# EAGLE design novanet (EAGLE 9.5.1)
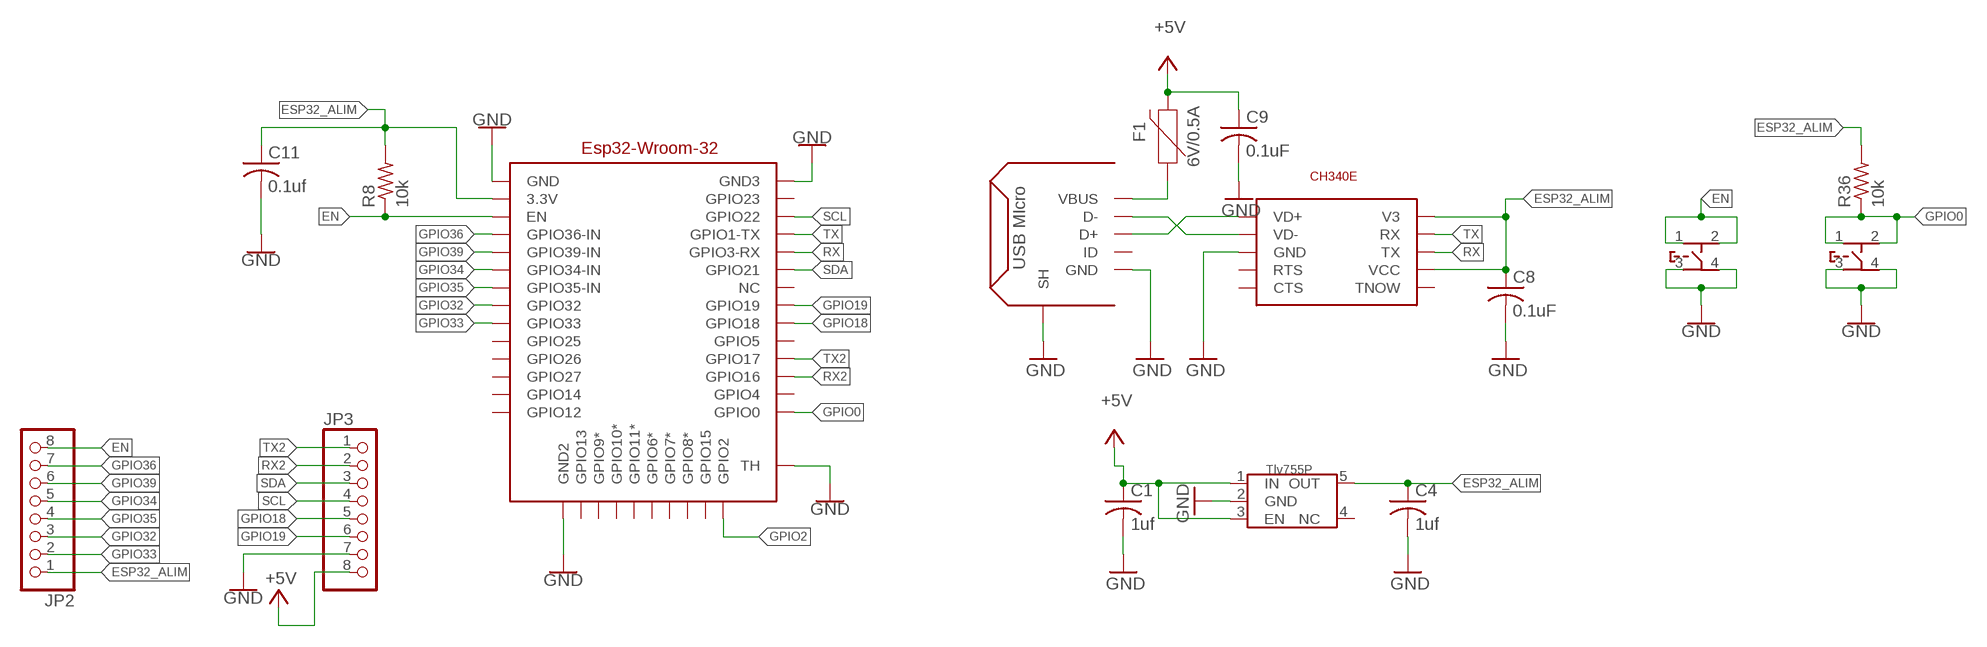
[diagram p0: schematic, sheet 1]

## Parts
C1  1uf  C-USC0603  [C0603]
C4  1uf  C-USC0603  [C0603]
C8  0.1uF  C-USC0603  [C0603]
C9  0.1uF  C-USC0603  [C0603]
C11  0.1uf  C-USC0603  [C0603]
F1  6V/0.5A  PPTC_HALF-AMP  [1206]
JP2  PINHD-1X8  [1X08]
JP3  PINHD-1X8  [1X08]
R8  10k  R-US_R0603  [R0603]
R36  10k  R-US_R0603  [R0603]
U$1  TLV755P-3.3SOT-23-5  [DBV_R-PDSO-G5]
U$3  CH340E  [MSOP-10]
U$4  ESP32-WROM-32  [ESP-32FOOTPRINT]
U$14  USB-MICROTIPOC  [USB-MICRO]
U$22  XUNPU  [TS-1089S]
U$23  XUNPU  [TS-1089S]

## Nets
+5V: C1.1 C9.1 F1.2 JP3.8 U$1.1(IN) U$1.3(EN)
EN: JP2.8 R8.1 U$4.EN U$22.1 U$22.2
ESP32_ALIM: C4.1 C8.1 C11.1 JP2.1 R8.2 R36.2 U$1.5(OUT) U$3.V3 U$3.VCC U$4.3.3V
GND: C1.2 C4.2 C8.2 C9.2 C11.2 JP3.7 U$1.2(GND) U$3.GND U$4.GND U$4.GND2 U$4.GND3 U$4.TH U$14.GND U$14.P$1(SH) U$14.P$2(SH) U$14.P$3(SH) U$14.P$4(SH) U$22.3 U$22.4 U$23.3 U$23.4
GPIO0: R36.1 U$4.GPIO0 U$23.1 U$23.2
GPIO2: U$4.GPIO2
GPIO18: JP3.5 U$4.GPIO18
GPIO19: JP3.6 U$4.GPIO19
GPIO32: JP2.3 U$4.GPIO32
GPIO33: JP2.2 U$4.GPIO33
GPIO34: JP2.5 U$4.GPIO34(GPIO34-IN)
GPIO35: JP2.4 U$4.GPIO35(GPIO35-IN)
GPIO36: JP2.7 U$4.GPIO36(GPIO36-IN)
GPIO39: JP2.6 U$4.GPIO39(GPIO39-IN)
N$3: U$3.VD- U$14.D-
N$4: U$3.VD+ U$14.D+
N$5: F1.1 U$14.VBUS
RX: U$3.TX U$4.GPIO3(GPIO3-RX)
RX2: JP3.2 U$4.GPIO16
SCL: JP3.4 U$4.GPO22(GPIO22)
SDA: JP3.3 U$4.GPIO21
TX: U$3.RX U$4.GPIO1(GPIO1-TX)
TX2: JP3.1 U$4.GPIO17
Unconnected: U$1.4(NC) U$3.CTS U$3.RTS U$3.TNOW U$4.GPIO4 U$4.GPIO5 U$4.GPIO6(GPIO6*) U$4.GPIO7(GPIO7*) U$4.GPIO8(GPIO8*) U$4.GPIO9(GPIO9*) U$4.GPIO10(GPIO10*) U$4.GPIO11(GPIO11*) U$4.GPIO12 U$4.GPIO13 U$4.GPIO14 U$4.GPIO15 U$4.GPIO23 U$4.GPIO25 U$4.GPIO26 U$4.GPIO27 U$4.NC U$14.ID

## Library data of the parts
C1 C4 C8 C9 C11 = rcl:C-US: CAPACITOR, American symbol; SPICEPREFIX: C
F1 = SparkFun-Fuses:PPTC: Resettable Fuse PPTC Resettable Fuse. Really a sort of resistor with a polymeric positive temperature coefficient whose resistance increases dramatically with an increase in temperature. When heated by the power passing through the resistance rises causing the current to be limited, protecting the circuit. This is achieved by the transition of the polymer from a crystalline to an amorphous state where the conductive carbon separates breaking the conductive pathways found in the cool crystalline structure. When a PPTC cools back down it resumes conducting letting the circuit turn back on. SparkFun Products: SparkFun RedBoard - Programmed with Arduino <https://www.sparkfun.com/products/12757> Pro Micro - 5V/16MHz <https://www.sparkfun.com/products/12640> Arduino Pro 328 - 5V/16MHz <https://www.sparkfun.com/products/10915> MP3 Trigger <https://www.sparkfun.com/products/13720>; PROD_ID: RES-08585
JP2 JP3 = pinhead:PINHD-1X8: PIN HEADER
R8 R36 = adafruit:R-US_: RESISTOR, American symbol
U$1 = tlv755p-3.3v:TLV755P-3.3
U$3 = Ch340E:CH340E
U$4 = Esp32-wrom-32:ESP32-WROM-32
U$14 = UsB micro:USB-MICROTIPOC
U$22 U$23 = TS-1089S-02526:XUNPU

## Board
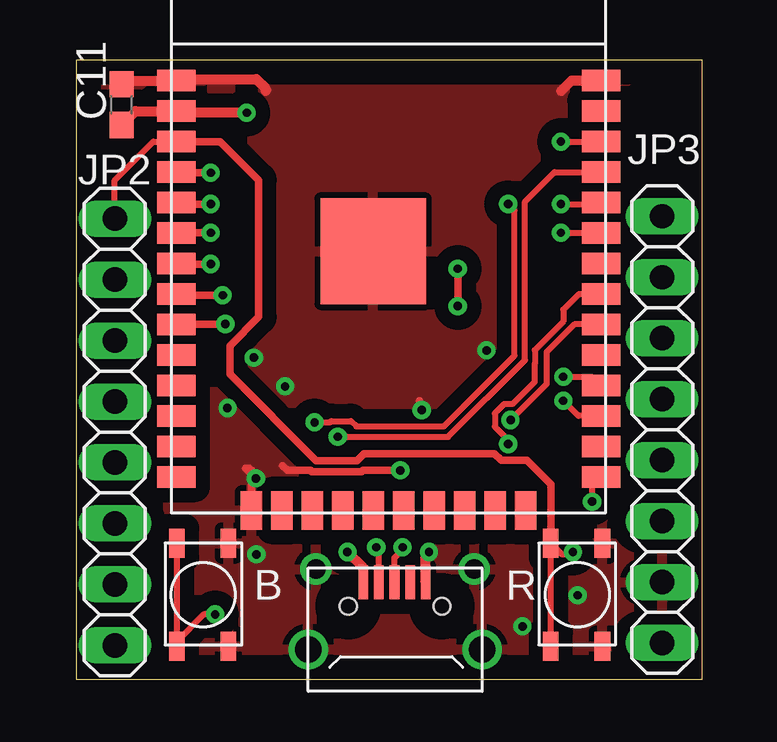
[diagram p1: board, top side]
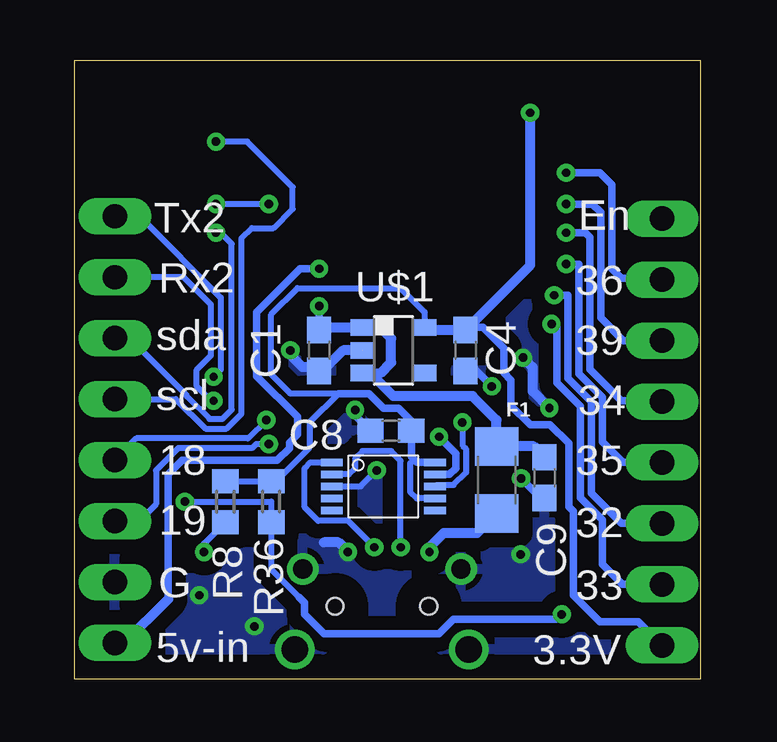
[diagram p2: board, bottom side, seen from below]

Size 26.1 x 25.8 mm. Coordinates in mm from the lower left corner, seen from the top.
Outline: 0,0 26.1,0 26.1,25.8 0,25.8 0,0
Copper layers (1*16): Top 0.035mm / dielectric 1.5mm / Bottom 0.035mm
Design rules "default *": minimum track width 6mil, minimum drill 0.35mm, track to track 6mil, track to pad 6mil, pad to pad 6mil, via to via 6mil, smd to smd 6mil, copper to edge 40mil, drill to drill 6mil, minimum pad ring 10mil, minimum via ring 8mil, stop-mask expansion 4mil, vias tented up to drill 14mil, thermal gap 10mil

### Footprints (pad centres in the part's own frame; a part is rotated, then mirrored left to right if it is on the bottom)
C0603 = smd 1.1 x 1: 1 -0.85,0; 2 0.85,0
1206 = smd 1.6 x 1.8: 1 -1.4,0; 2 1.4,0
1X08 = drill 1.016 long: 1 -8.89,0; 2 -6.35,0; 3 -3.81,0; 4 -1.27,0; 5 1.27,0; 6 3.81,0; 7 6.35,0; 8 8.89,0
R0603 = smd 1 x 1.1: 1 -0.85,0; 2 0.85,0
DBV_R-PDSO-G5 = smd 0.69 x 0.99: 1 -0.95,-1.29; 2 0,-1.29; 3 0.95,-1.29; 4 0.95,1.3; 5 -0.95,1.3
MSOP-10 = smd 0.9 x 0.305: CTS -2.16,-1.04; GND -2.16,-0.04; RTS -2.16,-0.54; RX 2.14,0.46; TNOW 2.14,-1.04; TX 2.14,-0.04; V3 2.14,0.96; VCC 2.14,-0.54; VD+ -2.16,0.96; VD- -2.16,0.46
ESP-32FOOTPRINT = smd 1.6 x 0.9: 3.3V -0.1,16.74; EN -0.1,15.47; GND -0.1,18.01; GND3 17.6,18.01; GPIO0 17.6,1.5; GPIO1 17.6,14.2; GPIO3 17.6,12.93; GPIO4 17.6,2.77; GPIO5 17.6,6.58; GPIO12 -0.1,1.5; GPIO14 -0.1,2.77; GPIO16 17.6,4.04; GPIO17 17.6,5.31; GPIO18 17.6,7.85; GPIO19 17.6,9.12; GPIO21 17.6,11.66; GPIO23 17.6,16.74; GPIO25 -0.1,6.58; GPIO26 -0.1,5.31; GPIO27 -0.1,4.04; GPIO32 -0.1,9.12; GPIO33 -0.1,7.85; GPIO34 -0.1,11.66; GPIO35 -0.1,10.39; GPIO36 -0.1,14.2; GPIO39 -0.1,12.93; GPO22 17.6,15.47; NC 17.6,10.39 | smd 0.9 x 1.6: GND2 3.03,0.1; GPIO2 14.46,0.1; GPIO6 9.38,0.1; GPIO7 10.65,0.1; GPIO8 11.92,0.1; GPIO9 5.57,0.1; GPIO10 6.84,0.1; GPIO11 8.11,0.1; GPIO13 4.3,0.1; GPIO15 13.19,0.1 | smd 4.4 x 4.4: TH 8.1,10.9
USB-MICRO = smd 1.4 x 0.4: D+ 2.8,3.65; D- 2.8,4.3; GND 2.8,2.35; ID 2.8,3; VBUS 2.8,4.95 | drill 1.1: P$1 0,0; P$2 0,7.25 | drill 0.8: P$3 3.35,0.325; P$4 3.35,6.925 | hole 0.7: 1.8,1.675; 1.8,5.575
TS-1089S = smd 1.2 x 0.65: 1 0,2.15; 2 4.3,2.15; 3 0,0; 4 4.3,0

### Placement (x,y rotation side)
C1  15.9,13.7 270 bottom
C4  9.8,13.7 270 bottom
C8  12.91,10.36 180 bottom
C9  6.5,8.4 270 bottom
C11  1.88,23.94 90 top
F1  8.5,8.3 90 bottom
JP2  1.6,10.3 90 top
JP3  24.42,10.4 270 top
R8  19.81,7.39 90 bottom
R36  17.9,7.4 90 bottom
U$1  12.8,13.7 270 bottom
U$3  13.21,8.07 0 bottom
U$4  4.27,6.93 0 top
U$14  16.91,1.24 90 top
U$22  21.93,1.37 90 top
U$23  6.34,1.37 90 top

### Tracks (layer width: path | path; a pad name or v marks a point on that pad's centre or on a via)
+5V  (via drill 0.35)
  Top 0.305: v15.9,17.1 v15.9,15.54
  Bottom 0.254: 18.3,9.1 18.31,9.11 | 15.9,14.6 15.88,14.58
  Bottom 0.305: 22.19,3.34 22.19,8.53 21.61,9.11 18.31,9.11 17.66,9.11 17.14,9.63 17.14,9.86 16.8,10.2 16.8,10.93 18.5,12.62 18.5,15.3 16.7,17.1 v15.9,17.1 | v15.9,15.54 15.9,14.6
  Bottom 0.406: C9.1 6.95,9.7 F1.2 8.5,10.8 9.5,11.8 12.8,11.8 13.75,12.75 | C1.1 15.88,14.58 15.8,14.65 U$1.1 13.35,14.65 12.9,14.2 12.9,13.2 13.35,12.75 13.75,12.75 | U$1.3 13.75,12.75 | JP3.8 24.02,1.51 22.19,3.34
EN  (via drill 0.35)
  Top 0.254: JP2.8 1.6,20.8 3.2,22.4 U$4.EN | U$22.1 U$22.2 20.25,5.2 20.8,5.2 v20.7,5.3
  Top 0.305: U$22.2 19.78,8.12 18.78,9.12 17.72,9.12 17.43,9.4 12,9.4 11.7,9.1 10,9.1 6.4,12.7 6.4,13.9 7.6,15.1 7.6,20.8 6,22.4 U$4.EN
  Bottom 0.254: v20.7,5.3 20.7,5.65 R8.1
ESP32_ALIM  (via drill 0.35)
  Top 0.406: v7.1,23.6 4.24,23.6 U$4.3.3V 2.46,23.67 C11.1
  Bottom 0.254: R8.2 R36.2 17.7,8.25 16.3,9.65 16.3,10.7 15.1,11.9 17.1,11.9 17.9,12.7 17.9,15.2 16.8,16.3 12.5,16.3 11.5,15.3 U$1.5 | U$3.VCC 11.82,7.53 12.09,7.8 12.09,9.01 11.95,9.15
  Bottom 0.305: 15.1,11.9 13.82,11.9 13.21,11.29 12.6,11.29 12.06,10.75 C8.1 12.06,9.26 11.95,9.15 11.83,9.03 U$3.V3 | JP2.1 2.59,2.4 4.2,2.4 5.3,3.5 5.3,7 5.5,7.19 5.5,9.83 6.27,10.6 7.1,10.6 7.9,11.4 7.9,12.47 8.2,12.77 8.2,13.8 9.07,14.68 9.67,14.68
  Bottom 0.406: U$1.5 11.4,14.55 C4.1 9.67,14.68 7.1,17.25 v7.1,23.6
GND  (via drill 0.35)
  Top 0.305: v14.4,11.22 14.3,11.32 14.3,11.6 | v13.5,8.7 11.95,8.7 11.89,8.64 9.81,8.64 9.75,8.7 8.8,8.7 8.6,8.9 | U$4.GND2 7.3,8.7 7.2,8.8 7.05,8.8 v7.48,8.37
  Top 0.406: C11.2 1.88,24.94 U$4.GND 4.23,25 7.5,25 7.9,24.6 7.9,24.5 | U$4.GND3 20.64,24.94 20.2,24.5 | U$14.GND 14.56,5.1 14.7,5.1 v14.7,5.3
  Bottom 0.254: U$3.GND 14.17,8.03 v13.5,8.7
  Bottom 0.305: v8.7,12.2 9.35,12.85 C4.2 | C8.2 14.4,11 v14.4,11.22 | v7.48,8.37 6.66,7.55 C9.2
  Bottom 0.406: v14.7,5.3 15.1,5.7 15.7,5.7 | v17.1,13.7 17.1,13.5 16.6,13 16.05,13 C1.2 15.75,12.85 14.9,13.7 U$1.2 | v6.3,11.3 6.99,11.99 6.99,12.58 7,12.58 7,13 v7.4,13.4
  other vias: 7.5,5.2 20.9,3.5 18.6,2.2
  pour Top (isolate 0.6): 0.1,25.7 25.9,25.7 25.9,0.1 0.1,0.1
  pour Bottom (isolate 0.6): 0.1,0.1 26,0.1 26,25.7 0.1,25.7
GPIO0  (via drill 0.35)
  Top 0.254: U$4.GPIO0 21.5,8.06 v21.5,7.4 | U$23.2 U$23.1 4.19,1.59 5.3,2.7 v5.78,2.7
  Bottom 0.254: v21.5,7.4 17.9,7.4 R36.1 17.9,4.58 16.73,3.41 16.73,3.4
  Bottom 0.305: 16.73,3.41 16.5,3.18 16.5,2.7 15.7,1.9 10.9,1.9 10.3,2.5 6,2.5 5.8,2.7 v5.78,2.7
GPIO18  (via drill 0.35)
  Top 0.254: U$4.GPIO18 20.76,14.78 19.6,13.62 19.6,12.3 v18.1,10.8
  Bottom 0.254: JP3.5 23.52,10.03 18.87,10.03 v18.1,10.8
GPIO19  (via drill 0.35)
  Top 0.254: U$4.GPIO19 20.95,16.05 20.3,15.4 20.3,14.9 19.11,13.71 19.11,13.13 19.1,13.12 19.1,12.38 18.18,11.46 17.83,11.46 17.44,11.07 17.44,10.53 18,9.97 v18,9.8
  Bottom 0.254: v18,9.8 18.53,9.8 18.7,9.62 21.78,9.62 22.7,8.7 22.7,7.3 23.41,6.59 JP3.6
GPIO32  (via drill 0.35)
  Top 0.305: v6.1,16 4.22,16 U$4.GPIO32
  Bottom 0.305: JP2.3 3.29,6.49 4.56,7.76 4.56,11.56 5.53,12.54 5.53,16 v6.1,16
GPIO33  (via drill 0.35)
  Top 0.305: v6.21,14.8 6.19,14.78 U$4.GPIO33
  Bottom 0.305: JP2.2 3.25,3.95 4.1,4.8 4.1,6.65 5.01,7.57 5.01,11.38 5.99,12.35 5.99,14.69 6.1,14.8 v6.21,14.8
GPIO34  (via drill 0.35)
  Top 0.305: v5.6,18.6 U$4.GPIO34
  Bottom 0.305: JP2.5 1.63,11.6 3.3,11.6 4.61,12.91 4.61,18.41 4.8,18.6 v5.6,18.6
GPIO35  (via drill 0.35)
  Top 0.305: v5.6,17.3 4.19,17.3 U$4.GPIO35
  Bottom 0.305: JP2.4 3.23,9.03 4.1,9.9 4.1,11.75 5.07,12.73 5.07,17.3 v5.6,17.3
GPIO36  (via drill 0.35)
  Top 0.305: v5.6,21.1 4.2,21.1 U$4.GPIO36
  Bottom 0.305: JP2.7 1.65,16.7 3.3,16.7 3.7,17.1 3.7,20.6 4.2,21.1 v5.6,21.1
GPIO39  (via drill 0.35)
  Top 0.305: v5.6,19.8 4.23,19.8 U$4.GPIO39
  Bottom 0.305: JP2.6 3.21,14.11 4.16,15.06 4.16,19.46 4.5,19.8 v5.6,19.8
N$3  (via drill 0.35)
  Top 0.254: U$14.D- 12.61,5.39 v12.5,5.5
  Bottom 0.254: U$3.VD- 14.67,8.53 14.4,8.8 14.4,9.2 14.1,9.5 12.9,9.5 12.5,9.1 v12.5,5.5
N$4  (via drill 0.35)
  Top 0.254: U$14.D+ 13.26,5.06 13.6,5.4 v13.6,5.5
  Bottom 0.254: v13.6,5.5 14.7,6.6 15.94,6.6 16.5,7.16 16.5,8.8 16.27,9.03 U$3.VD+
N$5  (via drill 0.35)
  Top 0.406: U$14.VBUS 11.96,4.64 v11.3,5.3
  Bottom 0.406: v11.3,5.3 11.3,5.5 10.7,6.1 9.3,6.1 F1.1
RX  (via drill 0.35)
  Top 0.254: v9.93,10.7 10.57,10.7 10.63,10.76 11.44,10.76 11.67,10.53 15.32,10.53 18.27,13.48 18.27,19.53 v18,19.8 | v20.2,19.8 21.81,19.8 U$4.GPIO3
  Bottom 0.254: U$3.TX 11,8.1 10.29,8.1 9.77,8.62 9.77,9.58 9.9,9.71 9.9,10.7 v9.93,10.7 | v18,19.8 v20.2,19.8
RX2  (via drill 0.35)
  Top 0.254: U$4.GPIO16 20.93,10.97 v20.3,11.6
  Bottom 0.254: v20.3,11.6 20.4,11.6 21,12.2 21,12.9 20.41,13.49 20.41,15.61 21.55,16.75 JP3.2
SCL  (via drill 0.35)
  Top 0.254: v20.2,22.4 U$4.GPO22
  Bottom 0.254: JP3.4 21.88,11.67 20.64,10.44 19.76,10.44 19.14,11.06 19.14,18.36 18.7,18.8 17.8,18.8 17,19.6 17,20.5 18.9,22.4 v20.2,22.4
SDA  (via drill 0.35)
  Top 0.254: v20.2,18.6 U$4.GPIO21
  Bottom 0.254: JP3.3 23.81,14.21 21.41,11.81 21.41,11.78 20.47,10.84 19.93,10.84 19.54,11.23 19.54,18.14 20,18.6 v20.2,18.6
TX  (via drill 0.35)
  Top 0.254: v10.9,10.1 15.5,10.1 18.7,13.3 18.7,19.9 19.93,21.13 U$4.GPIO1
  Bottom 0.305: U$3.RX 10.47,8.53 10.2,8.8 10.2,9.4 v10.9,10.1
TX2  (via drill 0.35)
  Top 0.254: v20.3,12.6 21.51,12.6 U$4.GPIO17
  Bottom 0.254: JP3.1 24.33,19.2 23.3,19.2 20,15.9 20,12.9 v20.3,12.6

### Text on the board
tPlace: B | R
bPlace: En | Tx2 | 36 | Rx2 | 39 | sda | 34 | scl | 35 | 18 | 32 | 19 | 33 | G | 3.3V | 5v-in